# EAGLE design JFET_S_R (EAGLE 9.6.2)
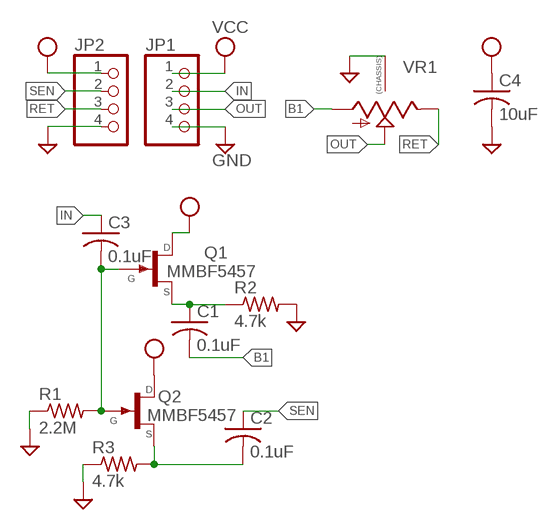
[diagram p0: schematic, sheet 1]

## Parts
C1  0.1uF  C-USC0402  [C0402]
C2  0.1uF  C-USC0402  [C0402]
C3  0.1uF  C-USC0402  [C0402]
C4  10uF  C-USC0805  [C0805]
JP1  PINHD-1X4  [1X04]
JP2  PINHD-1X4  [1X04]
Q1  MMBF5457  [SOT23]
Q2  MMBF5457  [SOT23]
R1  2.2M  R-US_R0402  [R0402]
R2  4.7k  R-US_R0402  [R0402]
R3  4.7k  R-US_R0402  [R0402]
VR1  9MM_SNAP-IN_POT_CHASSIS  [9MM_SNAP-IN_POT]

## Nets
B1: C1.2 VR1.1(A)
GND: C4.2 JP1.4 JP2.4 R1.1 R2.2 R3.1 VR1.CHASSIS1 VR1.CHASSIS2
IN: C3.1 JP1.2
N$1: C1.1 Q1.2(S) R2.1
N$2: C3.2 Q1.3(G) Q2.3(G) R1.2
N$3: C2.2 Q2.2(S) R3.2
OUT: JP1.3 VR1.2(S)
RET: JP2.3 VR1.3(E)
SEN: C2.1 JP2.2
VCC: C4.1 JP1.1 JP2.1 Q1.1(D) Q2.1(D)

## Library data of the parts
C1-C4 = adafruit:C-US: CAPACITOR, American symbol
JP1 JP2 = Connector:PINHD-1X4: PIN HEADER; CATEGORY: CONNECTOR; SUB-CATEGORY: PIN-HEADER
Q1 Q2 = MMBF5457:MMBF5457*: N-Channel JFET; AVAILABILITY: Unavailable; DESCRIPTION: JFET N-Channel 25V 350mW Surface Mount SOT-23-3; MF: ON Semiconductor; MP: MMBF5457; PACKAGE: SOT-23-3 Fairchild Semiconductor; PRICE: None
R1-R3 = adafruit:R-US_: RESISTOR, American symbol
VR1 = MusicThingModular:9MM_SNAP-IN_POT_CHASSIS: 9mm vertical snap-in pot, Alpha / Panasonic style, with a connection to the metal chassis for grounding

## Board
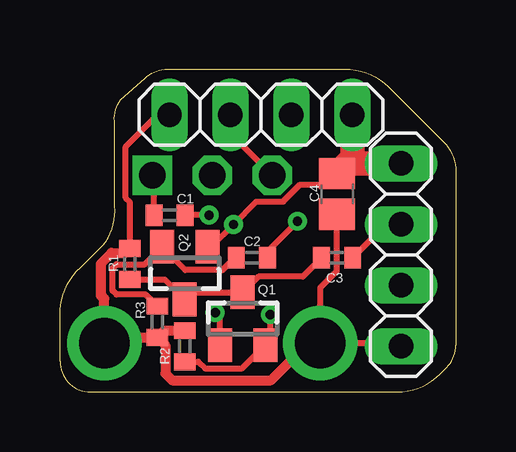
[diagram p1: board, top side]
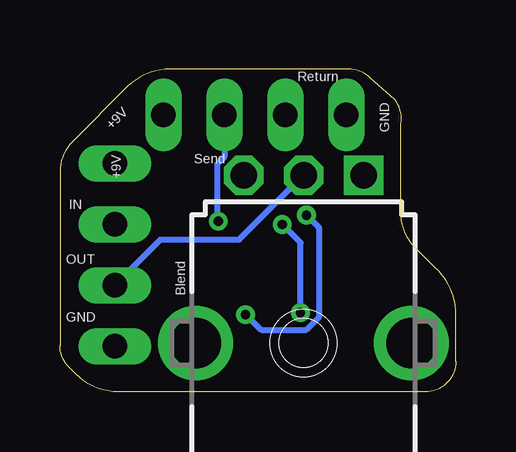
[diagram p2: board, bottom side, seen from below]

Size 16.51 x 13.46 mm. Coordinates in mm from the lower left corner, seen from the top.
Outline: 0,1.27 0,3.39 arc-45 0.87,5.19 1.78,6.1 arc45 2.29,7.75 2.29,11.18 arc-45 2.53,12.19 3.56,13.08 arc-45 4.48,13.46 11.9,13.46 arc-45 13.7,12.72 16,10.41 arc-45 16.51,9.19 16.51,1.94 arc-45 16.13,1.02 15.86,0.74 arc-45 14.06,0 1.27,0 arc-90 0,1.27
Copper layers (1*16): Top 0.035mm / dielectric 1.5mm / Bottom 0.035mm
Design rules "default *": minimum track width 6mil, minimum drill 0.35mm, track to track 6mil, track to pad 6mil, pad to pad 6mil, via to via 6mil, smd to smd 6mil, copper to edge 10mil, drill to drill 6mil, minimum pad ring 10mil, minimum via ring 8mil, stop-mask expansion 4mil, vias tented up to drill 0mil, thermal gap 10mil

### Footprints (pad centres in the part's own frame; a part is rotated, then mirrored left to right if it is on the bottom)
C0402 = smd 0.7 x 0.9: 1 -0.65,0; 2 0.65,0
C0805 = smd 1.3 x 1.5: 1 -0.85,0; 2 0.85,0
1X04 = drill 1.016 long: 1 -3.81,0; 2 -1.27,0; 3 1.27,0; 4 3.81,0
SOT23 = smd 1 x 1.4: 1 -0.95,-1.1; 2 0.95,-1.1; 3 0,1.1
R0402 = smd 0.7 x 0.9: 1 -0.65,0; 2 0.65,0
9MM_SNAP-IN_POT = drill 1.1 square: 1 -2.5,-7 | drill 1.1 octagon: 2 0,-7; 3 2.5,-7 | drill 2.1 pad 2.794: CHASSIS1 -4.5,0; CHASSIS2 4.5,0

### Placement (x,y rotation side)
C1  4.57,7.37 180 top
C2  8,5.59 180 top
C3  11.56,5.59 180 top
C4  11.56,8.26 270 top
JP1  14.22,5.71 270 top
JP2  8.38,11.56 180 top
Q1  7.62,3.05 0 top
Q2  5.21,4.95 180 top
R1  2.92,5.33 270 top
R2  5.21,1.91 90 top
R3  4.06,2.92 90 top
VR1  6.35,2.03 180 bottom

### Tracks (layer width: path | path; a pad name or v marks a point on that pad's centre or on a via)
B1
  Top 0.254: C1.2 3.92,8.96 VR1.1
GND
  Top 0.254: C4.2 11.54,7.38 11.54,5.02 10.85,4.34 VR1.CHASSIS2 14.1,2.03 JP1.4 | R1.1 2.92,7.92 2.75,8.09 2.75,10.24 4.06,11.56 JP2.4
  Top 0.406: R3.1 2.09,2.27 VR1.CHASSIS1 1.85,3.88 1.71,4.02 1.71,5.35 2.15,5.8 2.73,5.8 R1.1 | R3.1 4.35,2.56 R2.2 | VR1.CHASSIS2 10.36,2.03 8.81,0.49 4.67,0.49 4.4,0.76 4.4,1.93 R3.1
IN
  Top 0.254: C3.1 13.6,6.99 JP1.2
N$1  (via drill 0.38)
  Top 0.254: R2.1 5.77,1.25 6.05,0.97 7.59,0.97 Q1.2 8.77,2.15 v8.77,3.22 | v6.22,7.37 C1.1
  Bottom 0.254: v6.22,7.37 5.71,6.86 5.71,3.1 6.23,2.58 8.13,2.58 v8.77,3.22
N$2
  Top 0.254: R1.2 4.38,4.68 Q2.3 5.5,4.15 Q1.3 8.28,4.81 10.13,4.81 C3.2
N$3
  Top 0.254: C2.2 7.29,5.59 6.77,5.07 5.24,5.07 Q2.2 | Q2.2 | Q2.2 3.54,5.31 2.35,5.31 2.19,5.15 2.19,4.22 2.35,4.05 3.58,4.05 R3.2
OUT
  Bottom 0.254: JP1.3 12.32,6.35 9.03,6.35 VR1.2
RET
  Top 0.254: VR1.3 7.11,10.77 JP2.3
SEN  (via drill 0.38)
  Top 0.254: v9.91,7.11 8.65,5.86 C2.1
  Bottom 0.254: JP2.2 9.65,9.79 9.95,9.49 9.95,7.16 v9.91,7.11
VCC  (via drill 0.38)
  Top 0.254: Q1.1 6.67,3.11 v6.48,3.3 | Q2.1 6.31,6.05 v7.24,6.99 8.18,7.93 9.31,7.93 10.02,8.64 11.3,8.64 11.56,8.89 C4.1
  Top 1.016: JP2.1 12.19,9.74 C4.1 11.98,9.53 JP1.1
  Bottom 0.254: v6.48,3.3 6.48,6.22 v7.24,6.99

### Text on the board
bPlace: Return | GND | +9V | Send | +9V | IN | Blend | OUT | GND